# Altium project PCB_Project.PrjPcb
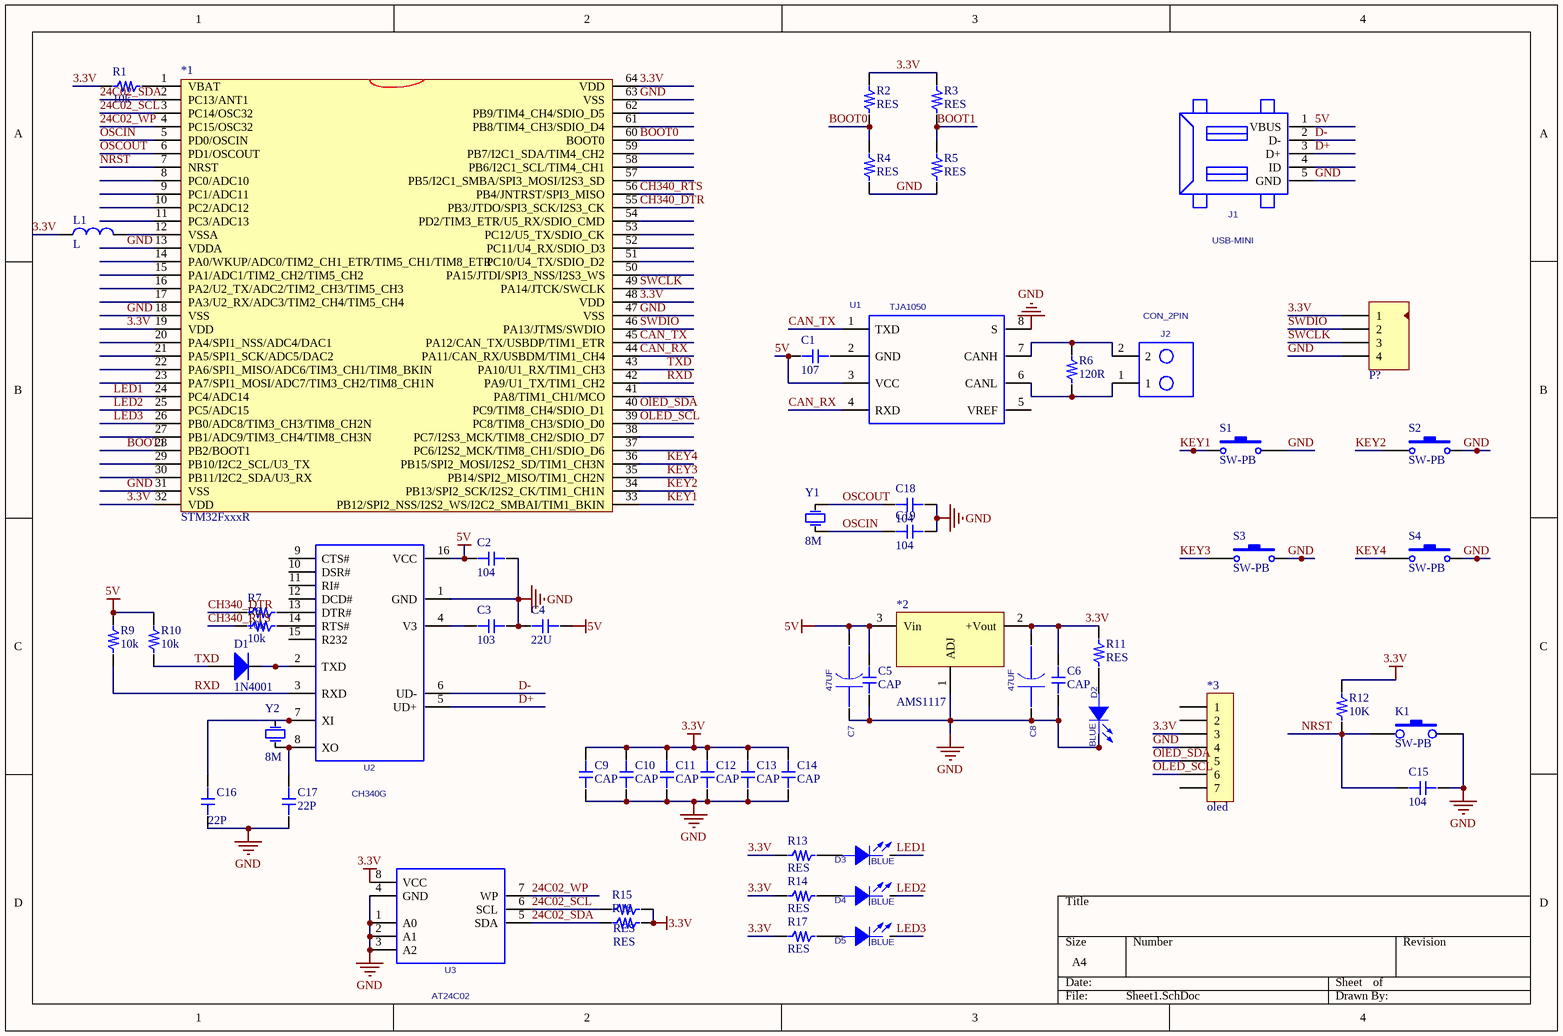
[diagram p0: Sheet1.SchDoc]
1 sheet, 58 parts. Net scope: global (net labels, ports and power ports of the same name join across sheets).
Board file: PCB1.PcbDoc

## Sheet Sheet1.SchDoc
size A4

### Parts
*1  STM32FxxxR  [LQFP64-10*10]
*2  AMS1117  [SOT-223]
*3  oled  [OLED_7]
C1  107  [C_0603]
C2  104  [C_0603]
C3  103  [C_0603]
C4  22U  [C_0603]
C5  CAP  [C_0603]
C6  CAP  [C_0603]
C7  value 47UF  [EC_6.5X6.5]  (hidden comment: CAP_6.5X6.5)
C8  value 47UF  [EC_6.5X6.5]  (hidden comment: CAP_6.5X6.5)
C9  CAP  [C_0603]
C10  CAP  [C_0603]
C11  CAP  [C_0603]
C12  CAP  [C_0603]
C13  CAP  [C_0603]
C14  CAP  [C_0603]
C15  104  [C_0603]
C16  22P  [C_0603]
C17  22P  [C_0603]
C18  104  [C_0603]
C19  104  [C_0603]
D1  1N4001  [D-1206]
D2  value BLUE  [LED_0603]  (hidden comment: LED)
D3  value BLUE  [LED_0603]  (hidden comment: LED)
D4  value BLUE  [LED_0603]  (hidden comment: LED)
D5  value BLUE  [LED_0603]  (hidden comment: LED)
J1  USB-MINI  [USB-MINI]
J2  CON_2PIN  [CON_2PIN]
K1  SW-PB  [SW-PB4]
L1  L  [L-0603]
P?  Header 4  [HDR4X1-2.54]  (value not drawn)
R1  10k  [R_0603]
R2  RES  [R_0603]
R3  RES  [R_0603]
R4  RES  [R_0603]
R5  RES  [R_0603]
R6  120R  [R_0603]
R7  10k  [R_0603]
R8  10k  [R_0603]
R9  10k  [R_0603]
R10  10k  [R_0603]
R11  RES  [R_0603]
R12  10K  [R_0603]
R13  RES  [R_0603]
R14  RES  [R_0603]
R15  RES  [R_0603]
R16  RES  [R_0603]
R17  RES  [R_0603]
S1  SW-PB  [SW_PB2_A1]
S2  SW-PB  [SW_PB2_A1]
S3  SW-PB  [SW_PB2_A1]
S4  SW-PB  [SW_PB2_A1]
U1  TJA1050  [SOP8]
U2  CH340G  [SOP16]
U3  AT24C02  [SOP8]
Y1  value 8M  [X-SM49]  (hidden comment: XTAL)
Y2  value 8M  [X-SM49]  (hidden comment: XTAL)

### Nets
3.3V: *1.19(VDD) *1.32(VDD) *1.48(VDD) *1.64(VDD) *2.2(+Vout) *3.3 C6.2 C8.2 C9.2 C10.2 C11.2 C12.2 C13.2 C14.2 L1.1 P?.1 R1.1 R2.2 R3.2 R11.2 R12.2 R13.2 R14.2 R15.2 R16.2 R17.2 U3.8(VCC)
5V: *2.3(Vin) C1.1 C2.2 C4.1 C5.2 C7.2 J1.1(VBUS) R9.1 R10.1 U1.3(VCC) U2.16(VCC)
GND: *1.13(VDDA) *1.18(VSS) *1.31(VSS) *1.47(VSS) *1.63(VSS) *2.1(ADJ) *3.4 C2.1 C3.1 C4.2 C5.1 C6.1 C7.1 C8.1 C9.1 C10.1 C11.1 C12.1 C13.1 C14.1 C15.2 C16.1 C17.1 C18.2 C19.2 D2.2(CATHODE) J1.5(GND) K1.2 P?.4 R4.1 R5.1 S1.2 S2.2 S3.2 S4.2 U1.8(S) U2.1(GND) U3.1(A0) U3.2(A1) U3.3(A2) U3.4(GND)
24C02_SCL: *1.3(PC14/OSC32) R15.1 U3.6(SCL)
24C02_SDA: *1.2(PC13/ANT1) R16.1 U3.5(SDA)
24C02_WP: *1.4(PC15/OSC32) U3.7(WP)
BOOT0: *1.60(BOOT0) R2.1 R4.2
BOOT1: *1.28(PB2/BOOT1) R3.1 R5.2
CAN_RX: *1.44(PA11/CAN_RX/USBDM/TIM1_CH4) U1.4(RXD)
CAN_TX: *1.45(PA12/CAN_TX/USBDP/TIM1_ETR) U1.1(TXD)
CH340_DTR: *1.55(PB3/JTDO/SPI3_SCK/I2S3_CK) R7.1
CH340_RTS: *1.56(PB4/JNTRST/SPI3_MISO) R8.1
D+: J1.3(D+) U2.5(UD+)
D-: J1.2(D-) U2.6(UD-)
KEY1: *1.33(PB12/SPI2_NSS/I2S2_WS/I2C2_SMBAI/TIM1_BKIN) S1.1
KEY2: *1.34(PB13/SPI2_SCK/I2S2_CK/TIM1_CH1N) S2.1
KEY3: *1.35(PB14/SPI2_MISO/TIM1_CH2N) S3.1
KEY4: *1.36(PB15/SPI2_MOSI/I2S2_SD/TIM1_CH3N) S4.1
LED1: *1.24(PC4/ADC14) D3.2(CATHODE)
LED2: *1.25(PC5/ADC15) D4.2(CATHODE)
LED3: *1.26(PB0/ADC8/TIM3_CH3/TIM8_CH2N) D5.2(CATHODE)
NRST: *1.7(NRST) C15.1 K1.1 R12.1
OLED_SCL: *1.39(PC8/TIM8_CH3/SDIO_D0) *3.6
OlED_SDA: *1.40(PC9/TIM8_CH4/SDIO_D1) *3.5
OSCIN: *1.5(PD0/OSCIN) C19.1 Y1.1(OSC1)
OSCOUT: *1.6(PD1/OSCOUT) C18.1 Y1.2(OSC2)
RXD: *1.42(PA9/U1_TX/TIM1_CH2) R9.2 U2.3(RXD)
SWCLK: *1.49(PA14/JTCK/SWCLK) P?.3
SWDIO: *1.46(PA13/JTMS/SWDIO) P?.2
TXD: *1.43(PA10/U1_RX/TIM1_CH3) D1.1(A) R10.2
Net*1_1: *1.1(VBAT) R1.2
Net*1_12: *1.12(VSSA) L1.2
NetC1_2: C1.2 U1.2(GND)
NetC3_2: C3.2 U2.4(V3)
NetC16_2: C16.2 U2.7(XI) Y2.2(OSC2)
NetC17_2: C17.2 U2.8(XO) Y2.1(OSC1)
NetD1_2: D1.2(K) U2.2(TXD)
NetD2_1: D2.1(ANODE) R11.1
NetD3_1: D3.1(ANODE) R13.1
NetD4_1: D4.1(ANODE) R14.1
NetD5_1: D5.1(ANODE) R17.1
NetJ2_1: J2.1 R6.1 U1.6(CANL)
NetJ2_2: J2.2 R6.2 U1.7(CANH)
NetR7_2: R7.2 U2.13(DTR#)
NetR8_2: R8.2 U2.14(RTS#)

Not connected (* = marked no-connect by the designer): *1 8(PC0/ADC10) 9(PC1/ADC11) 10(PC2/ADC12) 11(PC3/ADC13) 14(PA0/WKUP/ADC0/TIM2_CH1_ETR/TIM5_CH1/TIM8_ETR) 15(PA1/ADC1/TIM2_CH2/TIM5_CH2) 16(PA2/U2_TX/ADC2/TIM2_CH3/TIM5_CH3) 17(PA3/U2_RX/ADC3/TIM2_CH4/TIM5_CH4) 20(PA4/SPI1_NSS/ADC4/DAC1) 21(PA5/SPI1_SCK/ADC5/DAC2) 22(PA6/SPI1_MISO/ADC6/TIM3_CH1/TIM8_BKIN) 23(PA7/SPI1_MOSI/ADC7/TIM3_CH2/TIM8_CH1N) 27(PB1/ADC9/TIM3_CH4/TIM8_CH3N) 29(PB10/I2C2_SCL/U3_TX) 30(PB11/I2C2_SDA/U3_RX) 37(PC6/I2S2_MCK/TIM8_CH1/SDIO_D6) 38(PC7/I2S3_MCK/TIM8_CH2/SDIO_D7) 41(PA8/TIM1_CH1/MCO) 50(PA15/JTDI/SPI3_NSS/I2S3_WS) 51(PC10/U4_TX/SDIO_D2) 52(PC11/U4_RX/SDIO_D3) 53(PC12/U5_TX/SDIO_CK) 54(PD2/TIM3_ETR/U5_RX/SDIO_CMD) 57(PB5/I2C1_SMBA/SPI3_MOSI/I2S3_SD) 58(PB6/I2C1_SCL/TIM4_CH1) 59(PB7/I2C1_SDA/TIM4_CH2) 61(PB8/TIM4_CH3/SDIO_D4) 62(PB9/TIM4_CH4/SDIO_D5); *3 1 2 7; J1 4(ID); U1 5(VREF); U2 9(CTS#) 10(DSR#) 11(RI#) 12(DCD#) 15(R232)

### Library data of the parts
*3 = COM7-2.54
C1-C4 C15-C19 = CAP
C7 C8 = CAP_6.5X6.5: PCB DECAL: EC_47UF_6.5X6.5
D1 = Diode-R: 整流二极管; Published: 8-Jun-2000; LatestRevisionDate: 17-Jul-2002; LatestRevisionNote: Re-released for DXP Platform.; PackageDocument: Sep-1996; PackageReference: SMC; Publisher: Altium Limited
P? = Header 4: 接插件; LatestRevisionDate: 17-Jul-2002; LatestRevisionNote: Re-released for DXP Platform.; Publisher: Altium Limited
R1 R6-R10 R12 = RES
S1-S4 = SW-PB: 微动开关; Published: 24-Mar-1999; LatestRevisionDate: 17-Jul-2002; LatestRevisionNote: Re-released for DXP Platform.; PackageReference: SPST-2; Publisher: Altium Limited
Y1 Y2 = XTAL: 晶振; Published: 8-Jun-2000; LatestRevisionDate: 17-Jul-2002; LatestRevisionNote: Re-released for DXP Platform.; PackageReference: R38; Publisher: Altium Limited
D2-D5 = LED: PCB DECAL: LED_0603
J1 = USB-MINI: PCB DECAL: USB-MINI
J2 = CON_2PIN: PCB DECAL: CON_2PIN
U1 = TJA1050: PCB DECAL: SOP8
U2 = CH340G: PCB DECAL: SOP16
U3 = AT24C02: PCB DECAL: SOP8